# EAGLE board cartreader (EAGLE 7.6.0)
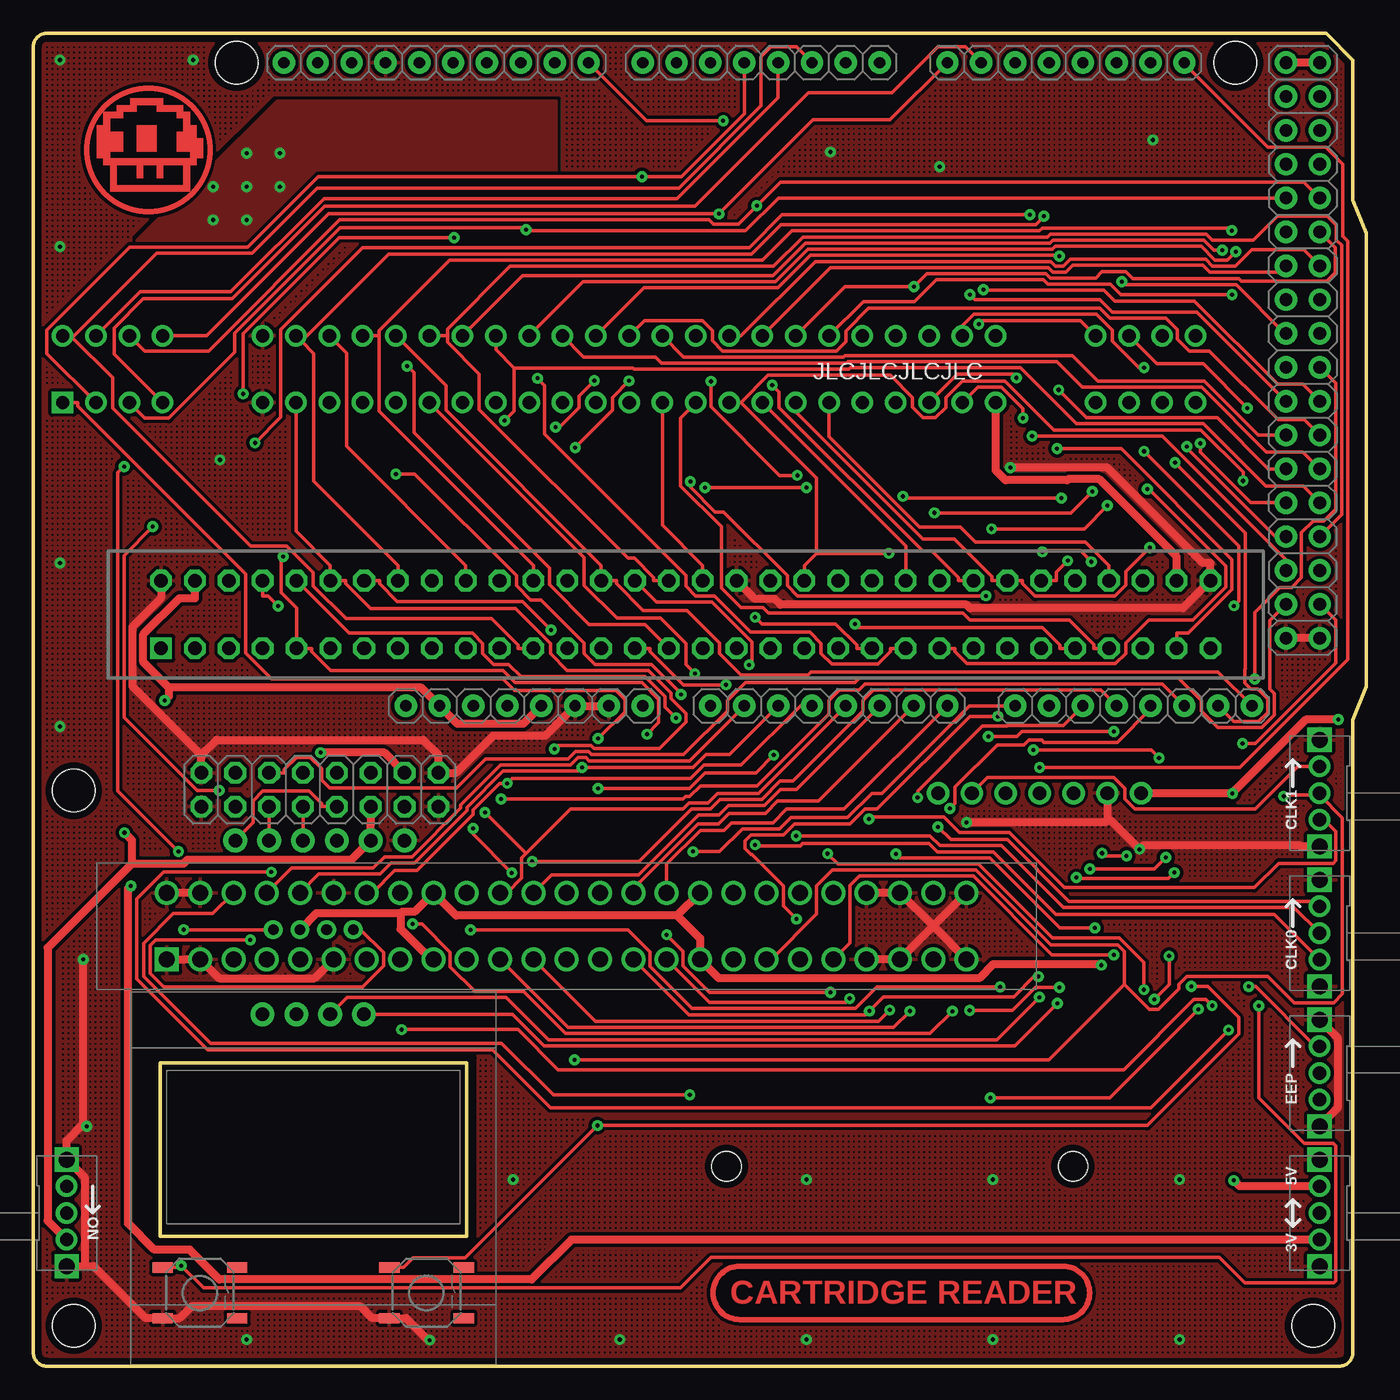
[diagram p1: board, top side]
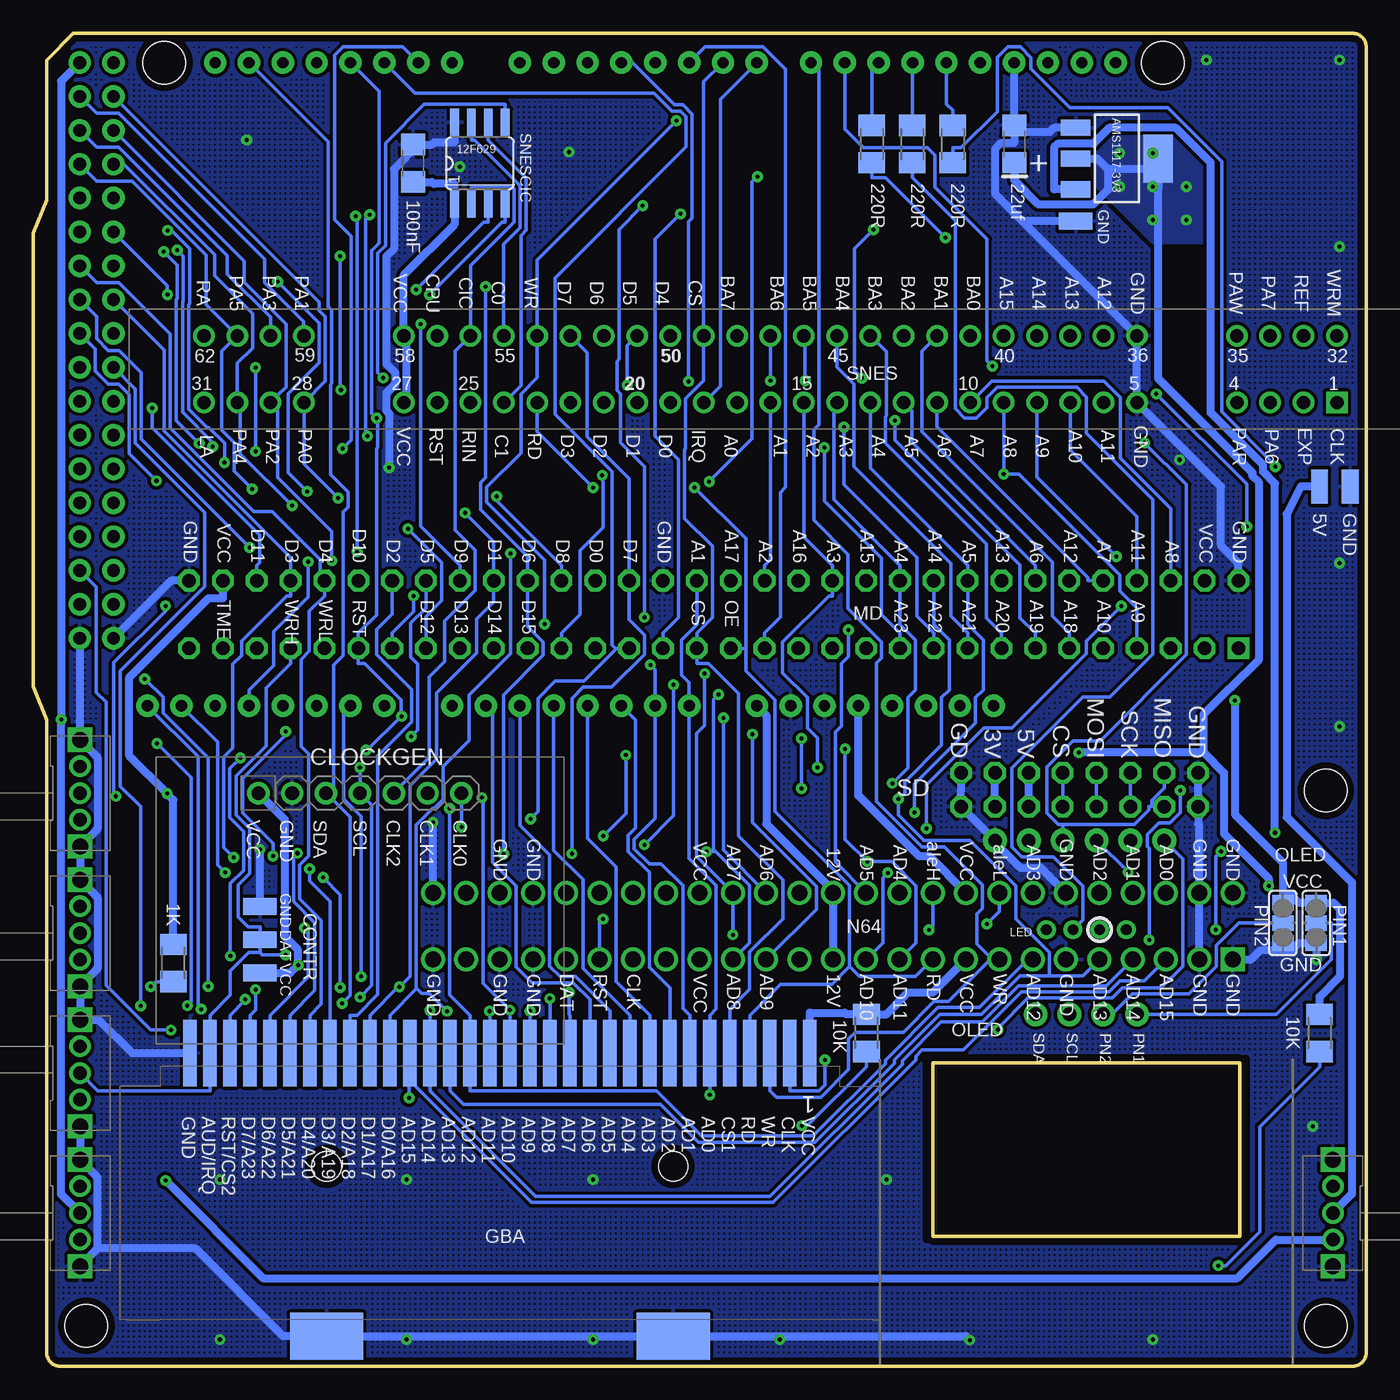
[diagram p2: board, bottom side, seen from below]

Size 100 x 100 mm. Coordinates in mm from the lower left corner, seen from the top.
Outline: 100,85 100,51 99,48.5 99,1 arc-90 98,0 1,0 arc-90 0,1 0,99 arc-90 1,100 97,100 99,98 99,87.5 100,85
Outline: 9.5,22.75 32.5,22.75 32.5,9.75 9.5,9.75 9.5,22.75
Copper layers (1*16): Top 0.035mm / dielectric 1.5mm / Bottom 0.035mm
Design rules "SparkFun_small": minimum track width 8mil, minimum drill 12mil, track to track 8mil, track to pad 8mil, pad to pad 8mil, via to via 8mil, smd to smd 8mil, copper to edge 20mil, drill to drill 12mil, minimum pad ring 12mil, minimum via ring 10mil, stop-mask expansion 4mil, vias tented up to drill 25mil, thermal gap 10mil
Net classes: 0 default: width 0.254 mm, drill 0.305 mm, clearance 0.203 mm; 1 power: width 0.61 mm, drill 0.406 mm, clearance 0.203 mm; 2 gnd: width 0.61 mm, drill 0.406 mm, clearance 0.203 mm; 3 power usb: width 0.61 mm, drill 0.406 mm, clearance 0.203 mm
Holes 3.2 mm at 3.04,3.04 96.02,3.04 3.04,43.18 15.24,97.8 90.17,97.8
tRestrict: area 9,9.5 to 33,23.1; area 5.8,88.1 to 11.8,88.6; area 5.8,88.6 to 6.2,89.1; area 11.2,88.6 to 11.8,89.1; area 5.8,89.1 to 6.2,89.6; area 7.8,89.1 to 8.2,89.6; area 9.2,89.1 to 9.8,89.6; area 11.2,89.1 to 11.8,89.6; area 5.8,89.6 to 6.2,90.1; area 7.8,89.6 to 8.2,90.1; area 9.2,89.6 to 9.8,90.1; area 11.2,89.6 to 11.8,90.1; 23 more areas; 7 lines
bRestrict: area 9,9.5 to 33,23.1

## Footprints (pad centres in the part's own frame; a part is rotated, then mirrored left to right if it is on the bottom)
M1206 = smd 1.6 x 2: 1 -1.4,0; 2 1.4,0
C1206 = smd 1.6 x 1.8: 1 -1.4,0; 2 1.4,0
1X08 = drill 0.85 pad 1.676: 1 -8.89,0; 2 -6.35,0; 3 -3.81,0; 4 -1.27,0; 5 1.27,0; 6 3.81,0; 7 6.35,0; 8 8.89,0
SOT223 = smd 1.219 x 2.235: 1 -2.311,-3.099; 2 0,-3.099; 3 2.311,-3.099 | smd 3.6 x 2.2: 4 0,3.099
PIC12F629 = smd 0.66 x 2.032: 1 -1.905,-3.073; 2 -0.635,-3.073; 3 0.635,-3.073; 4 1.905,-3.073; 5 1.905,3.073; 6 0.635,3.073; 7 -0.635,3.073; 8 -1.905,3.073
SWITCH-SPDT-2MM = drill 1: 1 0,2; 2 0,0; 3 0,-2 | drill 1.2 square: P$1 0,4; P$2 0,-4
CLOCKGEN = drill 1.016 pad 1.676: 1 -7.62,0; 2 -5.08,0; 3 -2.54,0; 4 0,0; 5 2.54,0; 6 5.08,0; 7 7.62,0
1X06-CLEANBIG = drill 1.016 pad 1.778: 1 -5.08,0; 2 -2.54,0; 3 0,0; 4 2.54,0; 5 5.08,0; 6 7.62,0
SMD1,27-2,54 = smd 1.27 x 2.54: 1 0,0
1X04-CLEANSMALL = drill 0.8 pad 1.422: 1 -3,0; 2 -1,0; 3 1,0; 4 3,0
MD-CART_SLOT = drill 1.016 square: 1 -39.37,-2.54 | drill 1.016 octagon: 2 -36.83,-2.54; 3 -34.29,-2.54; 4 -31.75,-2.54; 5 -29.21,-2.54; 6 -26.67,-2.54; 7 -24.13,-2.54; 8 -21.59,-2.54; 9 -19.05,-2.54; 10 -16.51,-2.54; 11 -13.97,-2.54; 12 -11.43,-2.54; 13 -8.89,-2.54; 14 -6.35,-2.54; 15 -3.81,-2.54; 16 -1.27,-2.54; 17 1.27,-2.54; 18 3.81,-2.54; 19 6.35,-2.54; 20 8.89,-2.54; 21 11.43,-2.54; 22 13.97,-2.54; 23 16.51,-2.54; 24 19.05,-2.54; 25 21.59,-2.54; 26 24.13,-2.54; 27 26.67,-2.54; 28 29.21,-2.54; 29 31.75,-2.54; 30 34.29,-2.54; 31 36.83,-2.54; 32 39.37,-2.54; 33 -39.37,2.54; 34 -36.83,2.54; 35 -34.29,2.54; 36 -31.75,2.54; 37 -29.21,2.54; 38 -26.67,2.54; 39 -24.13,2.54; 40 -21.59,2.54; 41 -19.05,2.54; 42 -16.51,2.54; 43 -13.97,2.54; 44 -11.43,2.54; 45 -8.89,2.54; 46 -6.35,2.54; 47 -3.81,2.54; 48 -1.27,2.54; 49 1.27,2.54; 50 3.81,2.54; 51 6.35,2.54; 52 8.89,2.54; 53 11.43,2.54; 54 13.97,2.54; 55 16.51,2.54; 56 19.05,2.54; 57 21.59,2.54; 58 24.13,2.54; 59 26.67,2.54; 60 29.21,2.54; 61 31.75,2.54; 62 34.29,2.54; 63 36.83,2.54; 64 39.37,2.54
OLED_I2C = drill 1.016 pad 1.778: 1 -3.81,0; 2 -1.27,0; 3 1.27,0; 4 3.81,0
1X10 = drill 0.85 pad 1.676: 1 -11.43,0; 2 -8.89,0; 3 -6.35,0; 4 -3.81,0; 5 -1.27,0; 6 1.27,0; 7 3.81,0; 8 6.35,0; 9 8.89,0; 10 11.43,0
TACTILE_SWITCH_SMD_5.2MM = smd 1.524 x 0.762: 1 -2.794,1.905; 2 2.794,1.905; 3 -2.794,-1.905; 4 2.794,-1.905
2X08 = drill 1.016 octagon: 1 -8.89,-1.27; 2 -8.89,1.27; 3 -6.35,-1.27; 4 -6.35,1.27; 5 -3.81,-1.27; 6 -3.81,1.27; 7 -1.27,-1.27; 8 -1.27,1.27; 9 1.27,-1.27; 10 1.27,1.27; 11 3.81,-1.27; 12 3.81,1.27; 13 6.35,-1.27; 14 6.35,1.27; 15 8.89,-1.27; 16 8.89,1.27
SJ_2 = smd 1.168 x 1.6: 1 -1.524,0; 2 0,0; 3 1.524,0
SNESCART_CONN_CLONE = drill 1 square: 1 -2.5,-42.5 | drill 1: 2 -2.5,-40; 3 -2.5,-37.5; 4 -2.5,-35; 5 -2.5,-27.5; 6 -2.5,-25; 7 -2.5,-22.5; 8 -2.5,-20; 9 -2.5,-17.5; 10 -2.5,-15; 11 -2.5,-12.5; 12 -2.5,-10; 13 -2.5,-7.5; 14 -2.5,-5; 15 -2.5,-2.5; 16 -2.5,0; 17 -2.5,2.5; 18 -2.5,5; 19 -2.5,7.5; 20 -2.5,10; 21 -2.5,12.5; 22 -2.5,15; 23 -2.5,17.5; 24 -2.5,20; 25 -2.5,22.5; 26 -2.5,25; 27 -2.5,27.5; 28 -2.5,35; 29 -2.5,37.5; 30 -2.5,40; 31 -2.5,42.5; 63 2.51,0.002; 64 2.51,-2.498; 65 2.51,-4.998; 66 2.51,-7.498; 67 2.51,-9.998; 68 2.51,2.502; 69 2.51,5.002; 70 2.51,7.502; 71 2.51,10.002; 72 2.51,12.502; 73 2.51,15.002; 74 2.51,17.502; 75 2.51,20.002; 76 2.51,-12.498; 77 2.51,-14.998; 78 2.51,-17.498; 79 2.51,-19.998; 80 2.51,-22.498; 81 2.51,22.502; 82 2.51,25.002; 83 2.51,27.502; 84 2.51,-27.498; 85 2.51,-24.998; 86 2.51,-34.998; 87 2.51,-37.498; 88 2.51,-39.998; 89 2.51,-42.498; 90 2.51,35.002; 91 2.51,37.502; 92 2.51,40.002; 93 2.51,42.502
N64-CART_SLOT_4 = drill 1.2 square: P1 -2.5,30 | drill 1.2: P2 -2.5,27.5; P3 -2.5,25; P4 -2.5,22.5; P5 -2.5,20; P6 -2.5,17.5; P7 -2.5,15; P8 -2.5,12.5; P9 -2.5,10; P10 -2.5,7.5; P11 -2.5,5; P12 -2.5,2.5; P13 -2.5,0; P14 -2.5,-2.5; P15 -2.5,-5; P16 -2.5,-7.5; P17 -2.5,-10; P18 -2.5,-12.5; P19 -2.5,-15; P20 -2.5,-17.5; P21 -2.5,-20; P22 -2.5,-22.5; P23 -2.5,-25; P24 -2.5,-27.5; P25 -2.5,-30; P26 2.5,30; P27 2.5,27.5; P28 2.5,25; P29 2.5,22.5; P30 2.5,20; P31 2.5,17.5; P32 2.5,15; P33 2.5,12.5; P34 2.5,10; P35 2.5,7.5; P36 2.5,5; P37 2.5,2.5; P38 2.5,0; P39 2.5,-2.5; P40 2.5,-5; P41 2.5,-7.5; P42 2.5,-10; P43 2.5,-12.5; P44 2.5,-15; P45 2.5,-17.5; P46 2.5,-20; P47 2.5,-22.5; P48 2.5,-25; P49 2.5,-27.5; P50 2.5,-30
GBA-SLOT-B = smd 5 x 1: 1 -5,23.25; 2 -5,21.75; 3 -5,20.25; 4 -5,18.75; 5 -5,17.25; 6 -5,15.75; 7 -5,14.25; 8 -5,12.75; 9 -5,11.25; 10 -5,9.75; 11 -5,8.25; 12 -5,6.75; 13 -5,5.25; 14 -5,3.75; 15 -5,2.25; 16 -5,0.75; 17 -5,-0.75; 18 -5,-2.25; 19 -5,-3.75; 20 -5,-5.25; 21 -5,-6.75; 22 -5,-8.25; 23 -5,-9.75; 24 -5,-11.25; 25 -5,-12.75; 26 -5,-14.25; 27 -5,-15.75; 28 -5,-17.25; 29 -5,-18.75; 30 -5,-20.25; 31 -5,-21.75; 32 -5,-23.25 | smd 3.5 x 5.5: SHIELD_3 16.25,13; SHIELD_4 16.25,-13 | hole 2.2: 3.5,13; 3.5,-13
2X18 = drill 0.95 pad 1.676: 1 -21.59,-1.27; 2 -21.59,1.27; 3 -19.05,-1.27; 4 -19.05,1.27; 5 -16.51,-1.27; 6 -16.51,1.27; 7 -13.97,-1.27; 8 -13.97,1.27; 9 -11.43,-1.27; 10 -11.43,1.27; 11 -8.89,-1.27; 12 -8.89,1.27; 13 -6.35,-1.27; 14 -6.35,1.27; 15 -3.81,-1.27; 16 -3.81,1.27; 17 -1.27,-1.27; 18 -1.27,1.27; 19 1.27,-1.27; 20 1.27,1.27; 21 3.81,-1.27; 22 3.81,1.27; 23 6.35,-1.27; 24 6.35,1.27; 25 8.89,-1.27; 26 8.89,1.27; 27 11.43,-1.27; 28 11.43,1.27; 29 13.97,-1.27; 30 13.97,1.27; 31 16.51,-1.27; 32 16.51,1.27; 33 19.05,-1.27; 34 19.05,1.27; 35 21.59,-1.27; 36 21.59,1.27

## Placement (x,y rotation side)
1K  [M1206]  89.5,30.25 270 bottom
10K  [M1206]  3.5,25 90 bottom
100NF  [C1206]  71.5,90.25 90 bottom
220R  [M1206]  31.02,91.69 90 bottom
1000R  [M1206]  37.5,25 90 bottom
+22UF  [C1206]  26.41,91.69 90 bottom
ADCH  8x1F-H8.5  [1X08]  82.55,49.54 0 top
ADCL  8x1F-H8.5  [1X08]  59.69,49.54 0 top
AMS1117-3V3  [SOT223]  18.7,90.6 270 bottom
CIC  PIC12F629_SIMPLE  [PIC12F629]  66.5,90.25 0 bottom
CLK0  [SWITCH-SPDT-2MM]  96.5,32.5 180 bottom
CLK1  [SWITCH-SPDT-2MM]  96.5,43 180 bottom
CLOCKGEN  [CLOCKGEN]  75.5,43 0 bottom
CN2  THT-PINHEADER_1X6-CLEANBIG  [1X06-CLEANBIG]  20.23,39.44 0 top
COMMUNICATION  8x1F-H8.5  [1X08]  77.47,97.8 180 top
CONTROLLER  [SMD1,27-2,54]  83,32 270 bottom
EEP  [SWITCH-SPDT-2MM]  96.5,22 0 top
LED  THT-PINHEADER_1X4_2MM-CLEANBIG  [1X04-CLEANSMALL]  21,32.75 0 top
MEGADRIVE  MD-CART_SLOT  [MD-CART_SLOT]  48.95,56.4 0 top
OLED  OLED_I2C-CLEANBIG  [OLED_I2C]  21,26.4 0 top
ONOFF  [SWITCH-SPDT-2MM]  2.5,11.5 180 top
PAD1  [SMD1,27-2,54]  21.8,85.9 270 bottom
PAD2  [SMD1,27-2,54]  83,34.5 270 bottom
PAD3  [SMD1,27-2,54]  83,29.5 270 bottom
PINS  10x1F-H8.5  [1X10]  30.23,97.8 0 top
POWER  8x1F-H8.5  [1X08]  36.83,49.54 0 top
PWML  8x1F-H8.5  [1X08]  54.61,97.8 180 top
R19  [M1206]  34.06,91.69 90 bottom
R20  [M1206]  37.1,91.69 90 bottom
S1  MOMENTARY-SWITCH-SPST-SMD-5.2MM  [TACTILE_SWITCH_SMD_5.2MM]  12.5,5.5 0 top
S2  MOMENTARY-SWITCH-SPST-SMD-5.2MM  [TACTILE_SWITCH_SMD_5.2MM]  29.5,5.5 0 top
SDCARD  [2X08]  21.5,43.25 180 top
SJ2  [SJ_2]  3.75,33.25 90 bottom
SJ4  [SJ_2]  6.25,33.25 90 bottom
U$1  SNESCART_CONN_CLONE  [SNESCART_CONN_CLONE]  44.7,74.8 90 bottom
U$2  N64-CART_SLOT_4  [N64-CART_SLOT_4]  40.02,33.02 90 top
U$4  GBA-SLOT-BSMD  [GBA-SLOT-B]  65,18.5 270 bottom
USB5V  [SMD1,27-2,54]  3.5,66 180 bottom
USBGND  [SMD1,27-2,54]  1.2,66 0 bottom
VOLTAGE  [SWITCH-SPDT-2MM]  96.5,11.5 180 bottom
XIO  18x2F-H8.5  [2X18]  95.25,76.21 270 top

## Tracks (layer width: path | path; a pad name or v marks a point on that pad's centre or on a via)
3V3  (via drill 0.3 pad 0.81)
  Top 0.61: SDCARD.3 26.34,46.03 v21.55,46.03 | VOLTAGE.1 40.38,9.5 37.39,6.52 13.96,6.52 11.73,8.74 9.07,8.74 7.1,10.71 7.1,35.81 v7.32,36.03
  Bottom 0.61: 12.19,46.03 v21.55,46.03 | 12.19,46.03 12.19,48.91 10.23,50.87 10.2,50.87 8.04,53.04 8.04,66.28 8.54,66.78 8.54,67.04 15.6,74.11 15.6,88.29 15.6,89.8 | 12.19,46.03 10.67,44.51 10.67,39.96 7.32,36.6 v7.32,36.03 | 19.37,89.8 20.17,90.6 AMS1117-3V3.2 | 15.6,89.8 19.37,89.8 | 19.37,89.8 19.37,88.27 20.49,87.15 24.58,87.15 26.41,88.98 +22UF.1 | AMS1117-3V3.4 15.6,89.8 | SDCARD.4 SDCARD.3
  other vias: 16,91 18.5,91 18.5,88.5 16,88.5 16,86 13.5,86 13.5,88.5
  pour Bottom (isolate 0.254, no thermals): 14.5,92.4 12.2,90.1 12.2,84.3 15.1,84.3 16,84.3 20.2,88.5 20.2,91.2 19,92.4
  pour Top (isolate 0.254, no thermals): 16.05,83.95 7.25,83.95 18.3,94.9 39.2,94.9 39.2,89.6 21.2,89.6 21.2,89.5
5V  (via drill 0.3 pad 0.81)
  Top 0.61: VOLTAGE.3 90.51,13.5 v90.08,13.93 | 7.41,37.71 7.41,39.45 v6.84,40.02 | 7.41,37.71 11.27,37.71 11.57,38.02 23.89,38.02 CN2.5 25.31,40.66 SDCARD.6 | 7.41,37.71 1.08,31.38 1.08,10.92 ONOFF.1
  Bottom 0.61: v90.08,13.93 82.76,6.61 9.67,6.61 6.78,9.5 ONOFF.1 | v6.84,40.02 6.84,66.23 7.72,67.12 7.72,67.59 11.67,71.53 11.67,90.3 14.28,92.91 19.28,92.91 20.47,91.72 23.15,91.72 23.42,91.44 23.42,88.29 AMS1117-3V3.3 | SDCARD.6 SDCARD.5
ADC0  (via drill 0.3 pad 0.81)
  Top 0.254: MEGADRIVE.49 50.22,60.08 47.2,63.1 U$1.17 | U$2.P28 13.47,33.97 10.5,33.97 8.27,31.73 8.27,29.26 13.3,24.23 35.13,24.23 39.02,20.35 v49.25,20.35
  Bottom 0.254: MEGADRIVE.49 50.22,57.8 50.22,55.65 51.38,54.49 51.38,51.87 50.8,51.3 ADCL.1 50.8,38.09 48.77,36.06 48.77,26.81 49.25,26.33 U$4.6 49.25,22.09 49.25,20.67 v49.25,20.35
ADC1  (via drill 0.3 pad 0.81)
  Top 0.254: ADCL.2 49.22,45.42 41.7,45.42 41.46,45.66 40.85,45.66 40.29,45.11 | 40.29,45.11 | 40.29,45.11 35.07,45.11 32.07,42.1 32.07,41.88 28.41,38.22 26.34,38.22 25.5,37.38 19.38,37.38 U$2.P29 | v53.71,52.62 53.93,52.84 53.93,54.33 50.92,57.34 46.74,57.34 MEGADRIVE.47
  Bottom 0.254: U$4.7 50.75,26.33 51.27,26.85 51.27,36.05 52.89,37.67 53.77,37.67 54.92,38.82 54.92,39.52 53.34,41.09 ADCL.2 53.34,52.25 v53.71,52.62 | MEGADRIVE.47 45.14,60.08 44.7,60.52 U$1.16
ADC2  (via drill 0.3 pad 0.81)
  Top 0.254: ADCL.3 52.22,45.88 50.46,45.88 49.51,44.93 v41.16,44.93 40.88,44.65 35.26,44.65 32.53,41.91 32.53,41.69 28.6,37.76 26.86,37.76 26.02,36.92 21.42,36.92 U$2.P30
  Bottom 0.254: ADCL.3 54.81,48.47 54.81,40.38 55.37,39.82 55.37,38.63 53.77,37.03 53.77,29.92 52.25,28.4 U$4.8 | v41.16,44.93 41.16,47.13 41.91,47.89 41.91,50.15 43.77,52.01 43.77,54.32 40.3,57.8 40.06,57.8 MEGADRIVE.45 40.06,60.08 42.2,62.22 U$1.15
ADC3  (via drill 0.3 pad 0.81)
  Top 0.254: ADCL.4 57.54,49.54 53.09,45.09 50.31,45.09 49.32,44.1 35.92,44.1 v35.56,43.73 34.99,43.73 32.98,41.72 32.98,41.38 28.8,37.19 27.11,37.19 25.44,35.52 U$2.P32
  Bottom 0.254: U$4.9 53.75,26.33 56.27,28.85 56.27,37.44 58.42,39.59 ADCL.4 | v35.56,43.73 34.39,44.9 34.39,50.15 33.8,50.74 33.8,54.47 34.98,55.65 34.98,57.8 MEGADRIVE.43 34.98,60.08 39.92,65.02 39.92,72.08 U$1.14
ADC4  (via drill 0.3 pad 0.81)
  Top 0.254: 36.96,38.47 40.3,41.81 48.75,41.81 49.21,42.27 50.61,42.27 51.32,42.98 54.4,42.98 ADCL.5 | 36.96,38.47 36.63,38.14 36.63,36.62 35.53,35.52 U$2.P36 | 36.96,38.47 v33.88,41.55
  Bottom 0.254: U$1.13 37.2,67.38 29.9,60.08 MEGADRIVE.41 29.9,55.65 28.73,54.48 28.73,50.73 29.31,50.15 29.31,48.26 33.88,43.69 v33.88,41.55 | U$4.10 55.25,26.33 58.77,29.85 58.77,36.5 60.96,38.69 ADCL.5
ADC5  (via drill 0.3 pad 0.81)
  Top 0.254: MEGADRIVE.39 25.96,58.94 25.96,58.7 27.29,57.38 36.71,57.38 v38.84,55.24 | U$2.P37 38.87,36.87 45.41,36.87 49.9,41.35 51.43,41.35 52.14,42.06 54.85,42.06 56.06,43.28 57.24,43.28 ADCL.6
  Bottom 0.254: U$2.P37 39.83,37.83 39.83,47.57 39.37,48.03 39.37,52.72 38.84,53.25 v38.84,55.24 | ADCL.6 63.5,40.59 61.26,38.34 61.26,30.01 60.48,29.23 59.31,29.23 56.75,26.67 56.75,26.33 U$4.11 | MEGADRIVE.39 24.82,60.08 34.07,69.33 34.07,71.67 U$1.12
ADC6  (via drill 0.3 pad 0.81)
  Top 0.254: U$2.P40 45.02,35.83 49.86,40.67 51.39,40.67 52.21,41.49 54.92,41.49 55.84,42.41 58.91,42.41 ADCL.7 | MEGADRIVE.37 23.68,55 32.94,55 33.71,54.24 33.71,53.47 34.52,52.66 35.67,52.66 36.58,51.74 45.89,51.74 47.39,50.24 47.39,49.45 v48.22,48.63
  Bottom 0.254: U$2.P40 48.22,38.72 v48.22,48.63 | U$1.11 32.2,70.48 20.88,59.16 20.88,58.94 MEGADRIVE.37 | ADCL.7 65.53,49.03 65.53,37.81 63.77,36.05 63.77,29.97 62.57,28.77 59.5,28.77 58.25,27.52 U$4.12
ADC7  (via drill 0.3 pad 0.81)
  Top 0.254: U$2.P41 47.52,37.67 50.06,40.21 51.83,40.21 52.39,40.77 55.5,40.77 56.52,41.79 60.83,41.79 ADCL.8 | U$1.10 41.33,60.67 41.33,58.58 43.8,56.12 47.06,56.12 48.95,54.23 48.95,52.63 v49.63,51.95 | v59.81,28.04 50.74,28.04 48.76,30.02 48.76,31.14 v47.52,32.37
  Bottom 0.254: v49.63,51.95 49.63,48.09 50.24,47.47 50.24,38.24 U$2.P41 v47.52,32.37 | v59.81,28.04 59.81,26.39 59.75,26.33 U$4.13 | U$1.10 28.1,73.9 19.68,73.9 18.45,72.67 18.45,68.12 14.66,64.33 14.66,60.08 MEGADRIVE.35
ADC8  (via drill 0.3 pad 0.81)
  Top 0.254: v61.25,27.58 60.97,27.3 50.74,27.3 U$2.P16 | ADCH.1 70.23,49.54 63.68,42.98 62.92,42.98 61.09,41.15 56.83,41.15 55.99,40.32 53.2,40.32 51.49,38.6 v49.51,38.6 | v48.59,50.39 48.59,50.46 46.39,52.66 42.14,52.66 41.33,53.47 41.33,54.26 38.11,57.48 37.32,57.48 36.25,58.55 36.25,59.3 28.62,66.93 v27.2,66.93
  Bottom 0.254: 48.97,38.6 48.97,50 v48.59,50.39 | U$2.P16 46.27,31.77 46.27,36.06 48.82,38.6 48.97,38.6 | 48.97,38.6 v49.51,38.6 | v61.25,27.58 61.25,26.33 U$4.14 | U$1.9 v27.2,66.93 26.06,66.93 18.47,59.34 18.47,58.17 17.2,56.9 17.2,55 MEGADRIVE.4
ADC9  (via drill 0.3 pad 0.81)
  Top 0.254: v75.4,29.23 75.08,29.23 73.56,27.71 63.8,27.71 v62.72,26.64 62.42,26.34 49.2,26.34 U$2.P15 | v18.74,60.74 18.59,60.59 18.59,58.03 19.74,56.88 19.74,55 MEGADRIVE.5 20.88,53.86 20.88,53.62 22.3,52.2 35.25,52.2 36.16,51.29 45.65,51.29 46.92,50.01 46.92,48.3 v46.03,47.41
  Bottom 0.254: ADCH.2 76.7,49.04 76.7,42.55 75.4,41.25 v75.4,29.23 | U$4.15 62.75,26.33 62.72,26.36 v62.72,26.64 | U$1.8 24.7,66.7 v18.74,60.74 | U$2.P15 41.26,34.28 41.26,36 46.03,40.78 v46.03,47.41
ADC10  (via drill 0.3 pad 0.81)
  Top 0.254: v66.35,42.66 66.35,43.17 71.2,48.02 73.05,48.02 73.11,48.07 77.27,48.07 ADCH.3 | U$2.P12 42.17,25.87 63.4,25.87 v64.25,26.72 | v35.9,37.02 32.99,39.93 v32.99,40.34 | MEGADRIVE.36 17.2,57.8 17.62,57.8 v18.38,57.03
  Bottom 0.254: v66.35,42.66 66.27,42.57 66.27,28.74 v64.25,26.72 64.25,26.33 U$4.16 | v18.38,57.03 21.01,54.41 21.01,53.45 26.57,47.9 28.69,47.9 32.99,43.6 v32.99,40.34 | U$1.7 22.2,68.74 17.2,63.74 17.2,60.08 MEGADRIVE.36 | U$2.P12 36.27,31.77 36.27,36.65 v35.9,37.02
ADC11  (via drill 0.3 pad 0.81)
  Top 0.254: v39.09,46.3 39.37,46.58 41.84,46.58 42.08,46.34 46.99,46.34 48.97,48.32 48.97,48.96 47.85,50.08 47.85,50.49 46.14,52.2 40.06,52.2 38.79,53.47 38.79,54.24 36.2,56.83 25.29,56.83 23.42,58.7 23.42,58.94 MEGADRIVE.38 22.28,60.08 19.7,62.66 U$1.6 | v37.43,37.86 45.44,37.86 49.4,41.81 50.8,41.81 51.51,42.52 54.66,42.52 56.04,43.9 56.98,43.9 62.23,49.15 62.23,49.94 63.02,50.73 80.09,50.73 ADCH.4 | U$2.P11 40.13,25.41 64.53,25.41 v65.76,26.64
  Bottom 0.254: v39.09,46.3 39.09,39.51 v37.43,37.86 35.6,37.86 33.77,36.03 33.77,31.77 U$2.P11 | U$4.17 65.75,26.33 65.76,26.34 v65.76,26.64
ADC12  (via drill 0.3 pad 0.81)
  Top 0.254: v79.37,60.35 78.54,61.18 75.79,61.18 v75.7,61.1 | ADCH.5 83.82,49.3 81.32,46.8 75.82,46.8 75.65,46.97 74.69,46.97 74.32,46.6 72.31,46.6 69.15,43.44 69.15,42.22 v68.77,41.84 | v75.83,86.28 75.2,85.65 56.09,85.65 53.87,83.44 26.66,83.44 20.12,76.89 | 20.12,76.89 21.03,75.98 21.03,66.41 27.36,60.08 MEGADRIVE.40 | U$1.85 20.12,76.89
  Bottom 0.254: v75.83,86.28 75.7,86.15 v75.7,61.1 | v68.77,41.84 68.77,27.85 67.25,26.33 67.25,24.91 U$4.18 67.25,20.67 53.26,20.67 49.87,17.28 41.49,17.28 36.09,22.69 36.09,22.93 32.12,26.9 29.01,26.9 25.4,30.52 U$2.P7 | ADCH.5 83.82,50.73 81.97,52.58 81.97,55.12 79.37,57.71 v79.37,60.35
ADC13  (via drill 0.3 pad 0.81)
  Top 0.254: v35.08,42.55 48.74,42.55 48.92,42.73 49.24,42.73 50.05,43.53 54.31,43.53 59.69,48.92 59.69,49.94 60.47,50.73 61.94,50.73 62.4,51.19 84.72,51.19 ADCH.6 | MEGADRIVE.42 32.44,60.08 23.51,69.02 23.51,76 U$1.80
  Bottom 0.254: 23.75,29.27 23.75,31.03 26.27,33.55 26.27,36.02 29.71,39.46 33.17,39.46 35.08,41.37 v35.08,42.55 34.62,43.02 34.62,43.83 31.85,46.59 31.85,50.15 31.26,50.74 31.26,54.47 32.44,55.65 MEGADRIVE.42 | 23.75,29.27 26,29.27 28.87,26.4 | 28.87,26.4 | 28.87,26.4 31.97,26.4 35.4,22.97 35.4,22.73 41.35,16.77 50.08,16.77 52.93,19.63 67.71,19.63 68.75,20.67 U$4.19 | U$2.P5 21.27,29.27 23.75,29.27
ADC14  (via drill 0.3 pad 0.81)
  Top 0.254: v85.6,37.03 85.15,36.58 78.34,36.58 v78.26,36.66 | v85.66,67.78 90.94,62.51 90.94,52.3 90.89,52.25 90.89,51.25 91.33,50.82 91.86,50.82 92.61,50.06 92.61,49.06 91.92,48.36 90.08,48.36 ADCH.7 | v70.25,26.69 73.45,26.69 75.19,28.42 v76.97,28.42 | v89.92,85.21 89.73,85.39 75.69,85.39 75.5,85.19 56.92,85.19 54.71,82.98 31.23,82.98 25.95,77.7 25.95,77.31 | 25.95,77.31 25.95,71.65 37.52,60.08 MEGADRIVE.44 | U$1.79 25.95,77.31
  Bottom 0.254: v76.97,28.42 76.97,35.38 v78.26,36.66 | v70.25,26.69 70.25,26.33 70.25,24.88 U$4.20 70.25,20.67 62.31,12.73 44.73,12.73 34.81,22.66 34.81,22.92 31.89,25.83 28.79,25.83 26.09,28.53 | v85.66,67.78 85.66,69.25 86.84,70.43 86.97,70.43 88.35,71.81 88.35,79.64 88.29,79.71 88.29,83.86 89.63,85.21 v89.92,85.21 | 26.09,28.53 | 26.09,28.53 19.51,28.53 U$2.P4 | v85.6,37.03 86.18,37.6 86.18,46.82 ADCH.7
ADC15  (via drill 0.3 pad 0.81)
  Top 0.254: ADCH.8 88.88,52.1 58.35,52.1 58.11,51.86 53.1,51.86 51.49,53.47 51.49,54.24 49.03,56.7 45.74,56.7 43.74,58.7 43.74,58.94 MEGADRIVE.46 42.6,59.23 42.6,60.08 30.95,71.73 30.95,73.56 | v87.41,26.79 80.75,20.13 v71.81,20.13 | 30.95,73.56 | 30.95,73.56 U$1.78
  Bottom 0.254: v87.41,26.79 87.63,27 87.63,45.73 ADCH.8 | 71.81,21.47 v71.81,20.13 | 71.81,21.47 62.62,12.28 44.5,12.28 33.8,22.98 33.8,23.25 33.32,23.73 30.2,23.73 25.86,28.08 19.32,28.08 18.49,28.9 16.64,28.9 U$2.P3 | 71.81,21.47 71.75,21.53 71.75,22.09 U$4.21
CICDATA0
  Bottom 0.254: U$1.75 64.7,84.18 63.47,85.41 63.47,88.56 66.89,91.98 67.14,91.98 CIC.7
CICDATA1
  Bottom 0.254: CIC.6 65.86,91.98 63.02,89.13 63.02,85.22 63.41,84.82 63.41,73.58 U$1.24
CICRSTSO  (via drill 0.3 pad 0.81)
  Top 0.254: U$1.25 69.34,74.44 73.48,74.44 v73.77,74.15
  Bottom 0.254: v73.77,74.15 74.15,74.53 74.15,83.51 73.58,84.08 73.58,91.76 70.67,94.67 64.59,94.67 CIC.5
CLK  (via drill 0.3 pad 0.81)
  Top 0.254: v55.55,45.84 54.22,44.51 50.38,44.51 49.23,43.35 v42.38,43.35 | v57.24,39.78 67.28,39.78 68,39.06 72.64,39.06 77.28,34.41 94.58,34.41 CLK0.2 | v42.38,47.09 44.39,49.1 44.39,50.02 43.7,50.71 36.09,50.71 35.25,51.55 17.87,51.55 15.93,53.49 15.93,59.44 3.33,72.03 3.33,72.3 U$1.1
  Bottom 0.254: v42.38,47.09 v42.38,43.35 | v57.24,39.78 55.55,41.47 v55.55,45.84
CLK0  (via drill 0.3 pad 0.81)
  Top 0.254: CLK0.3 96.13,34.87 77.71,34.87 73.07,39.51 68.83,39.51 v67.88,40.46
  Bottom 0.254: CLOCKGEN.7 v67.88,40.46
CLK1
  Top 0.254: CLOCKGEN.6 71.59,44.17 81.08,44.17 81.91,43.34 81.91,42.56 82.64,41.82 91.7,41.82 94.88,45 CLK1.3
CLK2
  Bottom 0.254: CLOCKGEN.5 70.29,45.67 70.29,51.7 69.14,52.85 69.14,55.9 66.84,58.2 66.84,61.23 68.34,62.74 68.34,76.17 U$1.81 67.2,82.56 63.93,85.83 63.93,88.36 64.09,88.52 67.14,88.52 CIC.2
CPUCLK  (via drill 0.3 pad 0.81)
  Top 0.254: v40.62,22.99 76.2,22.99 81.86,28.65 | 96.5,42.86 98.21,41.15 98.21,27.92 97.56,27.27 94.61,27.27 92.61,29.26 86.56,29.26 85.95,28.66 85.95,28.32 84.39,26.76 83.75,26.76 81.86,28.65 | U$1.82 69.7,78.06 70.56,78.92 79.76,78.92 80.95,77.73 80.95,76.91 82.93,74.93 v83.33,74.93 | 81.86,28.65 81.86,31.12 81.38,31.6 76.35,31.6 70.72,37.23 59.96,37.23 58.77,36.04 58.77,33.92 55.37,30.52 U$2.P19 | v90.08,57.04 90.44,57.41 90.44,61.53 v83.33,68.64 | 96.5,42.86 93.91,42.86 v93.8,42.76 | 96.5,42.86 CLK1.2
  Bottom 0.254: v93.8,42.76 93.95,42.91 93.95,52.78 90.08,56.65 v90.08,57.04 | U$4.2 43.25,20.67 41.07,20.67 40.62,21.12 v40.62,22.99 | v83.33,74.93 v83.33,68.64
GND  (via drill 0.3 pad 0.81)
  Top 0.61: v29.74,1.96 29.61,1.96 27.98,3.6 S2.3 25.44,3.6 24.55,4.48 11.87,4.48 10.98,3.6 S1.3 8.44,3.6 4.53,7.5 3.88,7.5 | EEP.P$1 97.87,24.63 97.87,19.37 EEP.P$2 | 80.58,40.93 80.45,40.79 v70.02,40.79 | 80.58,40.93 80.85,40.93 v83,38.78 83.3,39.08 95,39.08 95.09,39 CLK1.P$1 | CLOCKGEN.2 80.58,40.93 | U$2.P47 U$2.P48 67.52,33.02 | v73.3,67.43 80.57,67.43 87.73,60.26 88.32,60.26 MEGADRIVE.64 86.25,56.87 70.27,56.87 70.01,57.13 56.04,57.13 55.61,57.56 54.14,57.56 MEGADRIVE.50 | U$2.P22 U$2.P23 67.52,33.02 | v3.75,30.52 3.75,18.16 2.5,16.91 ONOFF.P$2 3.88,14.12 3.88,7.5 | ONOFF.P$1 3.88,7.5 | U$2.P27 U$2.P26 | 12.61,45.84 13.75,46.98 29.25,46.98 30.39,45.84 SDCARD.1 31.71,44.52 34.49,47.3 38.4,47.3 POWER.6 POWER.7 | 12.61,45.84 12.61,45.64 SDCARD.15 | MEGADRIVE.33 9.58,57.62 7.44,55.48 7.44,51.01 12.61,45.84 | U$2.P50 67.52,33.02 | 67.52,33.02 U$2.P25 | U$2.P6 21.1,29.1 13.94,29.1 U$2.P2 11.43,30.52 U$2.P1 | XIO.36 XIO.35
  Bottom 0.61: v29.74,1.96 30.04,2.25 U$4.SHIELD_3 U$4.SHIELD_4 81.26,2.25 87.83,8.83 95.17,8.83 | AMS1117-3V3.1 23.42,92.91 23.73,92.61 26.41,92.61 | 26.41,92.61 26.41,91.78 27.39,91.78 27.82,91.36 27.82,87.93 26.15,86.25 | 26.41,92.61 +22UF.2 26.41,94.4 26.42,94.4 PINS.4 | 25.45,85.55 U$1.84 U$1.5 10.9,66 10.9,61.58 9.58,60.26 MEGADRIVE.33 | 25.45,85.55 26.15,86.25 | U$4.32 92.59,23.5 95.09,26 EEP.P$1 CLK0.P$1 95.17,29.83 95.17,35.17 CLK0.P$2 CLK1.P$1 95.18,40.32 95.18,45.68 CLK1.P$2 96.5,48.41 96.52,48.43 XIO.36 | U$2.P50 v70.02,40.79 | v83,38.78 83,35.64 PAD2.1 | EEP.P$2 VOLTAGE.P$2 95.17,14.17 95.17,8.83 | 70.8,91.65 71.12,91.65 72.95,89.82 72.95,83.82 73.52,83.25 73.52,75.21 72.85,74.54 72.85,73.68 73.51,73.01 73.51,71.68 73.3,71.46 v73.3,67.43 | v3.75,30.52 3.75,30.63 SJ2.1 5.06,31.73 5.6,31.18 6.25,31.18 | U$2.P31 24.39,37.39 25.94,37.39 27.85,39.29 CN2.6 SDCARD.2 30.39,43.2 SDCARD.1 | U$2.P1 8.61,30.52 7.95,31.18 6.25,31.18 | U$2.P2 U$2.P27 12.52,40.57 12.61,40.66 SDCARD.16 SDCARD.15 | SJ4.1 6.25,31.18 | XIO.35 89.66,58.94 89.64,58.94 MEGADRIVE.64 | VOLTAGE.P$1 95.17,8.83 | 70.8,91.65 70.09,91.65 69.94,91.8 68.41,91.8 CIC.8 | 100NF.2 70.8,91.65 | 25.39,85.5 25.45,85.55 | PAD1.1 25.79,85.9 26.15,86.25
  other vias: 84,92 68,90 12,98 2,98 2,84 2,60.25 2,48 4,18 16,2 44,2 58,2 72,2 86,2 72,14 36,14 14,68 86,14 58,14 59.8,91.1
  pour Bottom (isolate 0.254, rank 2, hatched): 0,100 100,100 100,0 0,0
  pour Top (isolate 0.254, rank 2, hatched): 0,100 100,100 100,0 0,0
N$1  (via drill 0.3 pad 0.81)
  Top 0.254: EEP.1 96.19,24 91.71,28.48 v91.2,28.48
  Bottom 0.254: v91.2,28.48 90.83,28.85 1K.2
N$2
  Bottom 0.61: USB5V.1 4.89,66 5.96,63.93 5.96,41.2 1.07,36.31 1.07,12.93 ONOFF.2
N$3
  Top 0.406: 53,7.5 77.25,7.5 arc-90 79.25,5.5 arc-90 77.25,3.5 53,3.5 arc-90 51,5.5 arc-90 53,7.5
N$8
  Bottom 0.254: OLED.1 6.76,26.4 2.62,30.54 2.62,33.25 SJ2.2
N$9
  Bottom 0.254: OLED.2 19.08,26.4 17.55,27.93 13.32,27.93 11.26,30 11.26,31.56 9.57,33.25 7.38,33.25 SJ4.2
N$56
  Bottom 0.254: 220R.2 31.02,94.22 31.5,94.7 PINS.6
N$57
  Bottom 0.254: R19.2 34.06,94.22 34.04,94.24 PINS.7
N$58
  Bottom 0.254: R20.2 37.1,97.28 PINS.8
PA0  (via drill 0.3 pad 0.81)
  Top 0.254: v77.14,65.14 65.36,65.14 v65.24,65.26
  Bottom 0.254: XIO.3 78.56,79.84 78.56,79.2 78.11,78.74 78.11,73.89 U$1.28 79.7,67.7 v77.14,65.14 | v65.24,65.26 65.24,64.94 60.38,60.08 MEGADRIVE.53
PA1  (via drill 0.3 pad 0.81)
  Top 0.254: U$1.90 78.55,78.46 71.2,78.46 v70.93,78.19
  Bottom 0.254: XIO.4 95.25,93.99 93.59,93.99 82.64,83.04 82.64,81.29 79.7,78.35 U$1.90 | v70.93,78.19 70.93,63.01 68,60.08 MEGADRIVE.56
PA2  (via drill 0.3 pad 0.81)
  Top 0.254: v77.6,60.43 76.76,59.59 76.76,58.94 MEGADRIVE.59
  Bottom 0.254: 81.66,72.3 81.66,66.68 77.6,62.63 v77.6,60.43 | 81.66,72.3 81.66,72.84 81.05,73.45 81.05,78.19 84.18,81.32 84.18,82.92 XIO.5 | U$1.29 81.66,72.3
PA3  (via drill 0.3 pad 0.81)
  Top 0.254: U$1.91 84.31,75.2 87.77,75.2 v91.09,71.88
  Bottom 0.254: v91.09,71.88 91.09,70.43 83.03,62.37 83.03,60.29 83.24,60.08 MEGADRIVE.62 | XIO.6 95.25,91.45 93.59,91.45 85.45,83.32 85.45,81.95 82.2,78.7 U$1.91
PA4  (via drill 0.3 pad 0.81)
  Top 0.254: v80.59,64.57 78.84,62.82 v71.9,62.82
  Bottom 0.254: v80.59,64.57 84.47,68.45 84.47,72.07 U$1.30 84.7,75.25 83.55,76.4 83.55,78.98 86.41,81.83 86.41,83.38 93.2,90.18 XIO.7 | v71.9,62.82 69.35,60.28 69.35,57.44 70.54,56.25 MEGADRIVE.25
PA5  (via drill 0.3 pad 0.81)
  Top 0.254: v83.58,65.8 83.69,65.8 89.47,60.02 89.47,58.47 87,55.99 83.71,55.99 81.97,54.25 81.97,53.48 81.2,52.71 70.06,52.71 69.14,53.62 69.14,53.86 MEGADRIVE.24
  Bottom 0.254: XIO.8 95.25,88.91 92.58,88.91 87.02,83.35 87.02,79.63 U$1.92 85.87,76.14 85.87,70.24 84.92,69.29 84.92,67.15 v83.58,65.8
PA6  (via drill 0.3 pad 0.81)
  Top 0.254: XIO.9 55.9,87.64 53.45,85.19 37.04,85.19 v36.96,85.26 36.82,85.4 23.02,85.4 15.12,77.5 15.12,76.08 10.17,71.13 8.37,71.13 U$1.3 | v37.82,74.12 38.35,73.58 38.35,69.93 48.95,59.34 48.95,58.52 49.67,57.8 51.11,57.8 53.81,55.09 58.25,55.09 59.11,54.24 59.11,53.48 59.92,52.67 63.36,52.67 64.32,53.62 64.32,53.86 MEGADRIVE.23
  Bottom 0.254: v37.82,74.12 38.38,74.68 38.38,83.84 v36.96,85.26
PA7  (via drill 0.3 pad 0.81)
  Top 0.254: U$1.87 8.34,76.17 13.14,76.17 22.97,86 50.7,86 51.02,85.67 52.89,85.67 v54.28,87.06 56.06,88.84 95.31,88.84 XIO.10 | v54.16,56.19 54.66,55.68 60.2,55.68 61.78,54.1 61.78,53.86 MEGADRIVE.22
  Bottom 0.254: v54.16,56.19 54.16,67.51 55.95,69.3 55.95,72.94 56.22,73.22 56.22,75.39 56.06,75.55 56.06,85.28 v54.28,87.06
PB0  (via drill 0.3 pad 0.81)
  Top 0.254: v27.64,25.25 36.37,25.25 39.37,22.25 81.81,22.25 87.08,27.52 87.97,27.52 v88.44,27.05 | XIO.34 97.72,55.96 97.72,52.74 91.69,46.72 v90.72,46.72 | SDCARD.8 21.63,41.98 21.63,42.22 20.7,43.14 17.21,43.14 16.49,42.41 16.49,40.78 CN2.1
  Bottom 0.254: v90.72,46.72 88.17,44.17 88.17,27.32 v88.44,27.05 | v27.64,25.25 27.64,25.35 25.38,27.62 19.05,27.62 18.28,28.39 15.39,28.39 13.77,30 13.77,38.06 CN2.1 | SDCARD.7 SDCARD.8
PB1
  Top 0.254: XIO.33 92.78,55.96 92.78,50.79 93.11,50.46 93.11,48.85 92.17,47.91 88.88,47.91 87.63,49.16 87.63,49.93 85.92,51.64 61.99,51.64 61.65,51.29 53.43,51.29 52.07,49.93 52.07,49.15 48.8,45.88 41.89,45.88 41.65,46.12 40.66,46.12 40.1,45.56 33.94,45.56 31.74,43.37 22.24,43.37 21.63,43.98 21.63,44.85 20.79,45.69 19.76,45.69 18.83,44.76 18.83,44.52 SDCARD.11 | SDCARD.12 CN2.2
  Bottom 0.254: SDCARD.12 SDCARD.11
PB2  (via drill 0.3 pad 0.81)
  Top 0.254: v89.68,25.21 83.85,19.39 38.8,19.39 34.45,23.73 13.08,23.73 7.75,29.06 7.75,35.04 9.78,37.07 v17.86,37.07 | CN2.3 SDCARD.10
  Bottom 0.254: SDCARD.10 SDCARD.9 | XIO.32 95.27,58.45 95.27,50.53 94.55,49.82 94.55,40.74 94.52,40.7 94.52,28.55 91.18,25.21 v89.68,25.21 | v17.86,37.07 CN2.3
PB3  (via drill 0.3 pad 0.81)
  Top 0.254: v74.78,86.39 56.18,86.39 53.72,83.93 24.71,83.93 18.57,77.79 18.57,71.21 v16.63,69.27 | XIO.31 93.98,60.51 84.71,69.78 v74.94,69.78
  Bottom 0.254: SDCARD.13 15.15,43.38 16.09,42.44 16.09,41.98 | 16.09,41.98 16.29,41.98 16.29,41.74 17.38,40.66 22.77,40.66 | SDCARD.14 16.09,41.98 | 22.77,40.66 | 22.77,40.66 23.09,40.66 23.95,41.52 23.95,44.96 21.99,46.92 19.95,46.92 13.49,53.38 13.49,66.14 v16.63,69.27 | CN2.4 22.77,40.66 | v74.94,69.78 75.08,69.92 75.08,86.08 v74.78,86.39
PB4  (via drill 0.3 pad 0.81)
  Top 0.254: v13.95,43.2 12.28,43.2 6.8,48.67 6.8,60.83 v8.96,62.99 | LED.4 24.56,32.75 26.27,31.04 26.27,30.02 24.7,28.46 9.79,28.46 8.79,29.47 8.79,31.59 9.17,31.97 v16.29,31.97 | v31.58,84.67 22.93,84.67 15.73,77.47 v15.73,72.95
  Bottom 0.254: v15.73,72.95 8.96,66.18 v8.96,62.99 | v13.95,43.2 13.95,41.55 14.73,40.76 15.55,40.76 16.42,39.89 16.42,38.99 16.29,38.85 v16.29,31.97 | R20.1 37.1,89.16 36.07,89.16 v31.58,84.67
PB5
  Bottom 0.254: R19.1 34.06,89.16 30.84,85.94 30.84,71.83 30.14,71.13 29.24,71.13 28.45,71.92 28.45,72.66 27.66,73.44 21.72,73.44 20.98,72.7 20.98,70 16.01,65.03 16.01,53.43 19.23,50.21 21.24,50.21 26.58,44.87 26.58,38.97 25.82,38.21 23.46,38.21 21.27,36.02 21.27,33.48 LED.3
PB6  (via drill 0.3 pad 0.81)
  Top 0.254: LED.1 v11.27,32.75 | v10.89,38.63 6.35,43.17 6.35,67.03 v6.81,67.5
  Bottom 0.254: v10.89,38.63 11.27,38.24 v11.27,32.75 | 220R.1 31.02,91.42 30.4,91.42 27.69,94.14 27.69,98.19 26.9,98.98 25.94,98.98 25.15,98.19 25.15,97.34 22.24,94.43 14.89,94.43 10.84,90.38 10.84,71.6 6.81,67.57 v6.81,67.5
PC0  (via drill 0.3 pad 0.81)
  Top 0.254: v28.46,33.18 29.16,33.18 31.29,31.05 31.29,29.96 33.13,28.12 36.77,28.12 39.94,24.95 67.27,24.95 v68.95,26.64 | 58.76,60.98 v64.19,60.98 | 58.76,60.98 58.76,66.63 53.09,72.3 | 58.76,60.98 58.74,60.98 57.84,60.08 MEGADRIVE.52 | 53.09,72.3 U$1.19 | v90.76,66.43 | v90.76,66.43 90.76,67.07 87.59,70.24 76.57,70.24 72.89,73.92 69.72,73.92 68.45,72.66 68.45,71.9 67.7,71.15 66.74,71.15 65.95,71.94 65.95,72.69 64.29,74.34 55.14,74.34 53.09,72.3
  Bottom 0.254: 71.24,28.34 71.27,28.37 71.27,40.6 70.04,41.83 69.94,41.83 69.25,42.52 69.25,45 67.31,46.94 67.31,50.35 64.19,53.47 v64.19,60.98 | 71.24,28.34 70.88,27.98 70.29,27.98 v68.95,26.64 | 71.24,28.34 73.25,26.33 U$4.22 | v28.46,33.18 27.52,34.12 U$2.P33 | v90.76,66.43 92.81,68.47 92.81,72.89 93.59,73.67 94.38,73.67 95.35,74.65 95.35,76.31 XIO.18
PC1  (via drill 0.3 pad 0.81)
  Top 0.254: v67.61,64.02 77.85,64.02 v79.46,65.63 | v72.54,28.45 63.28,28.45 61.66,26.84 49.42,26.84 46.27,29.99 46.27,31.07 44.6,32.73 v32.8,32.73 | U$1.20 65.46,61.54 MEGADRIVE.55 | XIO.17 93.89,77.48 90.24,81.13 81.92,81.13 v81.67,81.37
  Bottom 0.254: v81.67,81.37 78.56,78.27 78.56,75.29 80.89,72.97 80.89,67.06 v79.46,65.63 | v67.61,64.02 65.46,61.87 MEGADRIVE.55 65.46,57.34 66.73,56.07 66.73,53.51 69.75,50.49 69.75,45.56 71.75,43.56 71.75,29.24 v72.54,28.45 72.63,28.45 74.75,26.33 U$4.23 | v32.8,32.73 32.52,33.02 U$2.P35
PC2  (via drill 0.3 pad 0.81)
  Top 0.254: U$1.21 57.2,71.59 66.75,62.04 69.12,62.04 71.94,59.23 71.94,58.94 MEGADRIVE.58 74.22,58.94 74.22,58.7 75.15,57.78 81.15,57.78 81.97,58.59 81.97,59.61 v83.77,61.41
  Bottom 0.254: XIO.16 95.25,78.75 95.25,77.08 94.38,76.21 93.55,76.21 91.9,74.56 91.9,69.54 v83.77,61.41 | MEGADRIVE.58 73.08,56.41 74.24,55.26 74.24,53.38 71.62,50.76 71.62,48.32 74.17,45.77 74.17,27.88 75.72,26.33 76.25,26.33 U$4.24
PC3  (via drill 0.3 pad 0.81)
  Top 0.254: MEGADRIVE.61 80.7,60.08 78.95,61.84 70.68,61.84 69.56,62.95 66.48,62.95 59.7,69.73 U$1.22 | v84.97,38.17 84.12,37.32 v79.28,37.32
  Bottom 0.254: v79.28,37.32 79.28,36.39 77.75,34.86 77.75,26.33 U$4.25 | v84.97,38.17 85.72,38.92 85.72,45.69 85.03,46.38 85.03,52.67 84.38,53.32 84.38,54.4 80.99,57.8 80.7,57.8 MEGADRIVE.61 80.7,60.69 90.18,70.17 90.18,76.22 XIO.15
PC4
  Top 0.254: U$1.70 53.1,77.31 58.67,82.88 76.35,82.88 76.68,82.55 77.29,82.55 77.79,83.05 87.95,83.05 88.47,82.53 90.17,82.53 91.41,83.76 95.32,83.76 XIO.14
  Bottom 0.254: XIO.14 95.25,81.29 93.59,81.29 89.72,77.42 89.72,70.36 83.48,64.12 82.09,64.12 78.48,60.52 78.48,59.26 MEGADRIVE.60 78.16,57.8 79.3,56.65 79.3,53.64 79.92,53.02 79.92,46.51 79.36,45.94 79.36,38.27 80.01,37.62 80.01,35.04 78.4,33.43 78.4,27.18 79.25,26.33 U$4.26
PC5  (via drill 0.3 pad 0.81)
  Top 0.254: v82.02,38.28 80.4,38.28 v80.19,38.49 | v55.44,73.6 55.95,73.09 55.95,71.93 66.74,61.14 67.43,61.14 69.4,59.18 69.4,58.94 MEGADRIVE.57 | U$1.71 59.82,82.42 76.16,82.42 76.49,82.09 77.48,82.09 77.98,82.59 87.76,82.59 88.28,82.07 93.49,82.07 XIO.13 | v71.66,47.24 73.78,47.24 74.15,47.62 v81.07,47.62
  Bottom 0.254: v80.19,38.49 80.47,38.21 80.47,34.85 78.88,33.26 78.88,28.2 80.75,26.33 U$4.27 | v81.07,47.62 81.07,47.34 84.3,44.11 84.3,41.52 82.02,39.23 v82.02,38.28 | U$1.71 55.44,76.57 v55.44,73.6 | v71.66,47.24 71.16,47.74 71.16,52.67 71.68,53.2 71.68,55.75 70.54,56.9 MEGADRIVE.57
PC6  (via drill 0.3 pad 0.81)
  Top 0.254: v79.65,32.87 77.03,32.87 71.76,38.14 65.01,38.14 v64.73,38.42 | XIO.12 97.7,83.92 97.7,82.06 97.03,81.39 90.63,81.39 90.43,81.58 82.5,81.58 81.97,82.11 80.18,82.11 79.71,81.63 76.3,81.63 75.97,81.97 67.04,81.97 v66.06,80.98 60.88,80.98 U$1.72
  Bottom 0.254: v64.73,38.42 64.73,50.36 61.74,53.35 61.74,54.32 62.92,55.5 MEGADRIVE.54 62.92,60.08 62.92,60.76 66.44,64.27 66.44,66.3 66.06,66.68 v66.06,80.98 | v79.65,32.87 79.38,32.61 79.38,29.2 82.25,26.33 U$4.28
PC7  (via drill 0.3 pad 0.81)
  Top 0.254: v83.33,28.25 | v83.33,28.25 83.33,30.29 81.49,32.13 76.46,32.13 70.91,37.68 60.36,37.68 v59.59,38.45 | U$1.73 62.27,79.88 66.12,79.88 67.75,81.51 75.78,81.51 76.11,81.18 80.82,81.18 81.61,80.39 v89.94,80.39
  Bottom 0.254: v59.59,38.45 59.59,50.09 58.74,50.94 56.6,50.94 54.16,53.39 54.16,54.87 55.3,56.01 MEGADRIVE.51 55.3,60.08 55.3,66.58 58.45,69.73 58.45,76.06 U$1.73 | XIO.11 89.94,81.06 v89.94,80.39 | v83.33,28.25 83.33,26.75 83.75,26.33 U$4.29
PD7  (via drill 0.3 pad 0.81)
  Top 0.254: v91.94,27.04 91.94,20.14 95.35,16.73 97.54,16.73 97.73,16.54 97.73,6.4 97.58,6.24 90.9,6.24 88.97,8.17 50.85,8.17 48.55,5.87 12.77,5.87 v11.09,7.54 10.95,7.41 S1.1
  Bottom 0.254: v91.94,27.04 91.94,41.99 93.46,43.51 93.46,52.17 87.14,58.49 87.14,64.03 92.35,69.24 92.35,73.31 XIO.19 | v11.09,7.54 10.52,7.54 8,10.07 8,17.97 3.5,22.47 10K.1
PE3  (via drill 0.3 pad 0.81)
  Top 0.254: v54.16,39.12 54.24,39.04 57.54,39.04 57.71,39.21 67.21,39.21 67.81,38.6 72.03,38.6 76.73,33.9 93.1,33.9 CLK0.1 | v51.97,51.12 48.78,51.12 46.28,53.62 46.28,53.86 MEGADRIVE.15
  Bottom 0.254: v54.16,39.12 51.97,41.31 v51.97,51.12 | PWML.6 49.6,99 45.26,99 43.56,97.3 43.56,65.94 43.95,65.56 43.95,56.19 45.14,55 MEGADRIVE.15
PE4
  Top 0.254: 2.94,77.18 5.95,74.17 5.95,71.89 16.32,61.53 19.02,61.53 21.01,59.54 21.01,58.55 23.48,56.08 34.39,56.08 36.38,54.1 36.38,53.86 MEGADRIVE.12 | U$1.89 2.81,77.31 2.94,77.18 | PWML.3 57.24,98.98 55.34,98.98 54.61,98.25 54.61,94.56 48.45,88.4 21.31,88.4 16.41,83.5 9.26,83.5 2.94,77.18
PE5  (via drill 0.3 pad 0.81)
  Top 0.254: PWML.4 55.88,95.19 48.3,87.6 21.8,87.6 14.82,80.61 8.01,80.61 U$1.88 | v57.32,66.84 | v57.32,66.84 56,66.84 50.84,72 v50.84,73.89 | v50.84,73.89
  Bottom 0.254: PWML.4 55.06,97.8 51.88,94.63 51.26,94.63 50.56,93.93 50.56,86.13 50.84,85.86 v50.84,73.89 | v57.32,66.84 57.26,66.78 57.26,62.91 58.98,61.19 58.98,56.4 60.38,55 MEGADRIVE.21
PG0  (via drill 0.3 pad 0.81)
  Top 0.254: v71.28,80.77 71.33,80.72 80.31,80.72 81.13,79.9 87.12,79.9 93.36,73.67 95.25,73.67 XIO.22
  Bottom 0.254: v71.28,80.77 66.22,85.83 65.86,85.83 CIC.3
PG1  (via drill 0.3 pad 0.81)
  Top 0.254: v70.26,80.4 70.62,80.03 80.02,80.03 80.97,79.09 87.29,79.09 XIO.21
  Bottom 0.254: v70.26,80.4 64.83,85.83 64.59,85.83 CIC.4
PG2  (via drill 0.3 pad 0.81)
  Top 0.254: v86.89,28.49 88.1,28.49 90.43,26.16 90.43,24.92 83.57,18.05 v42.32,18.05 32.39,8.12 28.51,8.12 27.8,7.41 S2.1 | XIO.20 97.71,73.75 97.71,64.31 96.81,63.41 96.03,63.41 95.15,62.53 95.15,59.17 94.41,58.43 93.51,58.43 91.63,56.55 v91.63,51.55
  Bottom 0.254: v91.63,51.55 90.27,50.19 90.27,49.02 86.89,45.64 v86.89,28.49 | v42.32,18.05 41.92,18.05 37.5,22.47 1000R.1
PG5  (via drill 0.3 pad 0.81)
  Top 0.254: PWML.5 53.34,93.97 48.62,89.25 v45.67,89.25 21.38,89.25 16.09,83.96 7.24,83.96 1.02,77.74 1.02,75.98 U$1.2 | v49.29,66.37 49.29,65.95 51.15,64.09 51.8,64.09 56.57,59.32 56.57,58.57 57.35,57.8 v71.47,57.8
  Bottom 0.254: v45.67,89.25 46.06,88.86 46.06,69.6 v49.29,66.37 | v71.47,57.8 71.47,56.62 73.08,55 MEGADRIVE.26
PH0  (via drill 0.3 pad 0.81)
  Top 0.254: v72.37,48.76 70.26,48.76 63.3,41.8 62.38,41.8 61.28,40.7 57.11,40.7 56.28,39.86 53.84,39.86 53.4,39.41 53.4,38.84 53.85,38.38 53.91,38.38 56.27,36.03 56.27,34.54 v57.27,33.54 | v85.21,30.77 85.21,28.62 v84.1,27.51 | v84.46,45.64 83.87,46.23 v75.03,46.23 | U$1.26 70.86,73.46 72.64,73.46 74.26,71.85 v74.26,71.13
  Bottom 0.254: 72.41,48.76 72.41,49.98 75.15,52.72 75.62,52.72 MEGADRIVE.27 75.62,55 74.26,56.37 74.26,68.84 74.17,68.92 74.17,71.04 v74.26,71.13 74.61,71.48 74.61,83.7 74.04,84.27 74.04,95.64 COMMUNICATION.5 | 72.41,48.76 v72.37,48.76 | v75.03,46.23 74.94,46.23 72.41,48.76 | v85.21,30.77 85.21,36.21 84.23,37.19 84.23,40.14 85.26,41.17 85.26,44.84 v84.46,45.64 | v84.1,27.51 84.1,27.48 85.25,26.33 U$4.30 | v57.27,33.54 57.52,33.29 U$2.P20
PH1  (via drill 0.3 pad 0.81)
  Top 0.254: CLK1.1 96.85,41 97.73,40.12 97.73,37.95 97.52,37.73 93.43,37.73 91.61,35.91 77.36,35.91 73.22,40.05 69.47,40.05 68.33,41.2 62.82,41.2 v62.69,41.07
  Bottom 0.254: 56.31,53.86 56.31,53.77 58.69,51.4 60.84,51.4 62.15,50.09 62.15,41.61 v62.69,41.07 | COMMUNICATION.6 71.37,95.51 53.42,95.51 52.09,94.17 51.45,94.17 51.02,93.74 51.02,91.49 60.87,81.64 60.87,71.43 56.57,67.13 56.57,54.12 56.31,53.86 | MEGADRIVE.19 56.31,53.86
PH3
  Bottom 0.254: U$4.5 47.75,26.78 46.27,28.26 46.27,31.07 43.77,33.57 43.77,36.47 47.09,39.79 47.09,50.48 49.33,52.72 50.22,52.72 50.22,53.57 MEGADRIVE.17 50.22,55 49.06,56.16 49.06,61.52 51.13,63.59 51.13,68.77 51.06,68.83 51.06,72.58 49.7,73.94 U$1.69 49.7,96.36 PWML.7
PH4  (via drill 0.3 pad 0.81)
  Top 0.254: v81.07,30.86 76.44,30.86 70.53,36.77 61.98,36.77 61.27,36.06 61.27,31.77 U$2.P21 | U$1.18 48.55,71.15 48.55,66.05 51.62,62.98 51.62,58.4 53.09,56.92 54.74,56.92 55.17,56.49 69.76,56.49 70.28,55.97 77.74,55.97 79.56,54.15 79.56,53.86 MEGADRIVE.29
  Bottom 0.254: U$1.18 48.45,73.55 48.45,95.07 PWML.8 | 83,31.04 82.83,30.86 v81.07,30.86 | 83,31.04 83.84,31.04 85.23,29.64 85.23,27.85 86.75,26.33 86.75,24.89 U$4.31 86.75,20.67 95.17,20.67 EEP.2 | 83,31.04 CONTROLLER.1 83,32.97 83.89,32.97 84.63,33.71 84.63,36.12 83.77,36.98 83.77,40.34 84.79,41.36 84.79,44.27 82.55,46.51 82.55,50.87 80.7,52.72 MEGADRIVE.29
PH5  (via drill 0.3 pad 0.81)
  Top 0.254: MEGADRIVE.28 77.02,53.86 77.02,54.1 75.7,55.42 61.92,55.42 v61.65,55.69 | v51.76,93.43 46.02,93.43 PINS.10
  Bottom 0.254: 28.12,30.59 29.2,31.67 29.2,33.94 28.79,34.35 28.79,36.11 31.64,38.96 33.32,38.96 36.74,42.38 36.74,52.76 36.37,53.13 36.37,54.33 38.87,56.83 38.87,60.9 41.43,63.47 41.43,70.26 41.06,70.63 41.06,97.21 PINS.10 | U$2.P8 28.05,30.52 28.12,30.59 | v61.65,55.69 61.65,60.49 65.98,64.82 65.98,65.95 63.41,68.52 63.41,72.94 62.2,74.15 U$1.74 62.2,82.99 v51.76,93.43 | 28.12,30.59 31.36,27.36 32.42,27.36 34.72,25.05 38.33,25.05 38.83,24.55 38.83,22.25 40.9,20.18 44.26,20.18 44.75,20.67 U$4.3
PH6  (via drill 0.3 pad 0.81)
  Top 0.254: v28.05,75.04 28.57,74.53 28.57,70.05 38.72,59.9 38.72,58.65 41.71,55.66 45.88,55.66 MEGADRIVE.16 | v50.39,65.93 v58.02,65.93
  Bottom 0.254: 38.77,29.98 38.02,29.23 33.81,29.23 U$2.P10 | 46.54,53.86 46.54,52.16 44.35,49.97 44.35,41.63 38.77,36.05 38.77,29.98 | 38.77,29.98 40.1,28.65 43.93,28.65 46.25,26.33 U$4.4 | U$1.23 62.2,70.11 v58.02,65.93 | 46.54,53.86 46.54,62.08 v50.39,65.93 | v28.05,75.04 28.45,75.44 28.45,84.57 32.35,88.47 32.35,90.87 32.9,91.42 37.73,91.42 39.12,92.81 PINS.9 | MEGADRIVE.16 46.54,53.86
PJ0  (via drill 0.3 pad 0.81)
  Top 0.254: COMMUNICATION.7 69.94,98.98 67.88,98.98 64.43,95.53 58.15,95.53 49.64,87.03 21.88,87.03 14.93,80.08 8.25,80.08 6.06,77.89 6.06,75.94 U$1.4 | MEGADRIVE.31 85.78,55 86.67,55 89.94,58.27 89.94,60.53 81.62,68.84 v76.81,68.84
  Bottom 0.254: COMMUNICATION.7 72.3,98.98 76.74,98.98 77.38,98.34 77.38,86.01 76.16,84.79 76.16,69.49 v76.81,68.84
PJ1  (via drill 0.3 pad 0.81)
  Top 0.254: U$1.86 12.99,77.31 22.14,86.46 v51.43,86.46 v51.44,86.45 58.49,93.5 64.28,93.5 COMMUNICATION.8
  Bottom 0.254: MEGADRIVE.18 52.76,55 51.59,56.17 51.59,68.02 53.34,69.76 53.34,84.55 v51.44,86.45
PL0
  Top 0.254: 31.07,77.31 31.07,76.83 33.45,74.45 33.45,71.78 44.62,60.61 45.1,60.61 46.54,59.18 46.54,58.94 MEGADRIVE.48 | XIO.30 98.17,63.89 98.17,84.1 97.77,84.5 97.77,85.6 97.08,86.3 93.35,86.3 91.52,84.47 88.47,84.47 88,84.94 76.29,84.94 76.07,84.71 57.73,84.71 55.54,82.52 35.77,82.52 31.07,77.82 31.07,77.31 | 31.07,77.31 U$1.77
PL1  (via drill 0.3 pad 0.81)
  Top 0.254: U$1.76 36.72,81.82 55.49,81.82 57.92,84.25 76.26,84.25 76.48,84.48 87.81,84.48 88.56,83.73 v89.2,83.73 | XIO.29 93.18,62.24 86.54,68.88 v86.54,69
  Bottom 0.254: v86.54,69 86.54,69.3 88.81,71.57 88.81,79.83 88.74,79.89 88.74,83.28 v89.2,83.73 | U$1.76 33.34,76.17 33.34,70.11 23.55,60.32 23.55,56.27 22.28,55 MEGADRIVE.6
PL2  (via drill 0.3 pad 0.81)
  Top 0.254: 36.06,74.89 36.06,71.65 v35.35,70.93 | 36.06,74.89 34.7,76.25 U$1.67 | XIO.28 95.28,66.02 92.46,66.02 87.78,70.7 78.26,70.7 74.05,74.91 61.29,74.91 61.18,74.8 45.08,74.8 44.99,74.89 36.06,74.89
  Bottom 0.254: v35.35,70.93 35.35,69.48 25.96,60.1 25.96,56.15 24.82,55 MEGADRIVE.7
PL3  (via drill 0.3 pad 0.81)
  Top 0.254: U$1.66 41.26,81.37 55.68,81.37 58.11,83.8 76.44,83.8 76.67,84.02 87.62,84.02 88.66,82.98 89.58,82.98 v90.22,83.63 | XIO.27 91.34,64.78 87.55,68.57 v87.55,69.24
  Bottom 0.254: U$1.66 35.99,76.1 35.99,71.33 36.08,71.24 36.08,69.26 28.5,61.68 28.5,56.15 27.36,55 MEGADRIVE.8 | v90.22,83.63 89.2,82.61 89.2,80.08 89.26,80.02 89.26,70.95 v87.55,69.24
PL4
  Top 0.254: U$1.65 41.3,75.71 46.67,75.71 47.12,75.26 60.99,75.26 61.1,75.37 76.78,75.37 78.71,73.44 87.67,73.44 92.52,68.59 95.25,68.59 XIO.26
  Bottom 0.254: MEGADRIVE.9 29.9,55 31.17,56.27 31.17,60.23 38.44,67.5 38.44,73.69 39.7,74.95 U$1.65
PL5  (via drill 0.3 pad 0.81)
  Top 0.254: U$1.64 45.8,80.91 55.87,80.91 58.3,83.34 76.93,83.34 v76.99,83.28 | XIO.25 92.67,67.32 88.83,71.16 79.02,71.16 v76.93,73.25 | v42.09,73.94 40.95,72.8 40.95,71.9 39.5,70.45 v39.18,70.45
  Bottom 0.254: v76.99,83.28 76.99,73.31 v76.93,73.25 | v39.18,70.45 39.18,66.14 33.71,60.67 33.71,56.27 32.44,55 MEGADRIVE.10 | U$1.64 42.09,77.2 v42.09,73.94
PL6  (via drill 0.3 pad 0.81)
  Top 0.254: U$1.63 45.84,78.45 50.2,78.45 50.95,77.69 50.95,76.94 51.72,76.17 60.24,76.17 60.95,76.88 60.95,77.67 62.66,79.38 80.03,79.38 80.78,78.63 84.98,78.63 85.84,77.78 85.84,77.06 86.72,76.17 88.24,76.17 93.39,71.03 95.35,71.03 XIO.24 | v40.66,68.93 43.45,71.72 43.45,72.68 v44.7,73.93
  Bottom 0.254: v40.66,68.93 40.66,64.9 36.38,60.62 36.38,56.4 34.98,55 MEGADRIVE.11 | U$1.63 v44.7,73.93
PL7
  Top 0.254: U$1.68 48.8,75.71 60.8,75.71 60.91,75.83 77.94,75.83 79.87,73.9 87.86,73.9 91.9,69.86 XIO.23
SCL  (via drill 0.3 pad 0.81)
  Top 0.254: OLED.3 23.53,27.66 35.48,27.66 38.66,24.49 72.29,24.49 v75.49,27.68 | v75.5,44.91 90.53,44.91 98.63,53.01 98.63,84.4 98.23,84.8 98.23,90.2 96.98,91.45 92.62,91.45 86.36,97.71 COMMUNICATION.1
  Bottom 0.254: v75.49,27.68 74.62,28.55 74.62,42.12 CLOCKGEN.4 v75.5,44.91
SDA  (via drill 0.3 pad 0.81)
  Top 0.254: OLED.4 35.94,26.4 38.31,24.03 73.66,24.03 v76.84,27.21
  Bottom 0.254: v76.84,27.21 76.24,27.81 76.24,41.2 CLOCKGEN.3 77.47,43.57 77.47,52.62 76.76,53.32 76.76,64.08 76.37,64.47 76.37,65.59 77.69,66.91 77.69,73.66 77.61,73.74 77.61,79.22 77.88,79.48 77.88,91.86 COMMUNICATION.2
VCC  (via drill 0.3 pad 0.81)
  Top 0.61: 89.97,43 v89.97,42.97 | CLOCKGEN.1 89.97,43 | v97.91,48.51 95.48,48.51 89.97,43 | v80.14,30.09 80.08,30.14 72.01,30.14 70.97,29.1 51.44,29.1 U$2.P17 50.02,32.1 48.31,33.81 | U$1.27 72.2,67.21 72.94,66.47 77.55,66.47 77.63,66.55 79.97,66.55 85.78,60.74 85.78,60.26 MEGADRIVE.63 | U$2.P42 48.31,33.81 | 48.31,33.81 31.73,33.81 U$2.P34 28.6,34.1 27.67,34.1 27.54,33.97 | 10.16,50.92 8.26,52.82 8.26,54.91 10.96,57.62 12.12,57.62 MEGADRIVE.34 | 10.16,50.92 29.1,50.92 POWER.2 31.83,48.19 36.75,48.19 POWER.5 | 10.16,50.92 10.16,50.26 v9.86,49.95 | 27.54,33.97 21.22,33.97 LED.2 | 27.54,33.97 27.54,32.8 29.83,30.52 U$2.P9 | XIO.2 XIO.1
  Bottom 0.61: XIO.2 97.91,96.41 v97.91,48.51 97.93,48.49 97.93,12.93 VOLTAGE.2 | 1K.1 89.5,42.5 v89.97,42.97 92.79,45.79 92.79,51.68 86.86,57.62 85.78,57.62 MEGADRIVE.63 | U$2.P34 32.75,38.25 33.53,38.25 38.1,42.81 POWER.5 | CLOCKGEN.1 81.11,40.99 81.11,32.19 80.14,31.22 v80.14,30.09 80.72,29.5 81.29,29.5 PAD3.1 | v9.86,49.95 9.86,41.4 6.25,37.79 6.25,35.32 | U$1.27 71.99,72.51 71.99,77.09 U$1.83 72.2,81.86 68.41,85.65 CIC.1 68.41,88.7 69.94,88.7 70.09,88.85 100NF.1 | U$2.P9 32.51,28.03 34.36,28.03 35.99,26.4 1000R.2 39.01,26.4 39.12,26.51 41.75,26.51 U$4.1 | 6.25,35.32 5.6,35.32 5.06,34.77 SJ2.3 2.44,34.77 1.96,34.3 1.96,29.24 3.5,27.71 10K.2 | SJ4.3 6.25,35.32
VIN
  Bottom 0.61: U$2.P13 U$2.P38 40.02,35.7 45,40.68 45,48.82 POWER.8
(copper drawn outside any net)
  shapes: Top area x33, Top circle x1

## Text on the board
Top: CARTRIDGE READER
bPlace: +
tNames: JLCJLCJLCJLC | CLK1 | CLK0 | EEP | 5V | 3V | ON
bNames: SNESCIC | 12F629 | 22uf | 220R | 220R | 220R | 1 | 100nF | GND | WRM / / REF / / PA7 / / PAW / / / / / / GND / / A12 / / A13 / / A14 / / A15 / / BA0 / / BA1 / / BA2 / / BA3 / / BA4 / / BA5 / / BA6 / / / BA7 / / CS / / D4 / / D5 / / D6 / / D7 / / WR / / C0 / / CIC / / CPU / / VCC / / / / / / PA1 / / PA3 / / PA5 / / RA | SNES | CLK / / EXP / / PA6 / / PAR / / / / / / GND / / A11 / / A10 / / A9 / / A8 / / A7 / / A6 / / A5 / / A4 / / A3 / / A2 / / A1 / / / A0 / / IRQ / / D0 / / D1 / / D2 / / D3 / / RD / / C1 / / RIN / / RST / / VCC / / / / / / PA0 / / PA2 / / PA4 / / LA | GND | 5V | GND / / VCC / / A8 / / A11 / / A7 / / A12 / / A6 / / A13 / / A5 / / A14 / / A4 / / A15 / / A3 / / A16 / / A2 / / A17 / / A1 / / GND / / D7 / / D0 / / D8 / / D6 / / D1 / / D9 / / D5 / / D2 / / D10 / / D4 / / D3 / / D11 / / VCC / / GND | A9 / / A10 / / A18 / / A19 / / A20 / / A21 / / A22 / / A23 / / / / / / / / / / OE / / CS / / / / / / / / / / D15 / / D14 / / D13 / / D12 / / / / RST / / WRL / / WRH / / / / TME | MD | GND | MISO | SCK | MOSI | CS | 5V | 3V | GD | SD | CLK0 | CLK1 | CLK2 | SCL | SDA | GND | VCC | OLED | VCC | GND / / GND / / AD0 / / AD1 / / AD2 / / GND / / AD3 / / aleL / / VCC / / aleH / / AD4 / / AD5 / / 12V / / / / AD6 / / AD7 / / VCC / / / / / / / / / / GND / / GND | GND | PIN1 | PIN2 | 1K | CONTR | DAT | N64 | GND | VCC | GND / / GND / / AD15 / / AD14 / / AD13 / / GND / / AD12 / / WR / / VCC / / RD / / AD11 / / AD10 / / 12V / / / / AD9 / / AD8 / / VCC / / / / CLK / / RST / / DAT / / GND / / GND / / / / GND | 10K | 10K | PN1 | PN2 | SCL | SDA | OLED | VCC / CLK / WR / RD / CS1 / AD0 / AD1 / AD2 / AD3 / AD4 / AD5 / AD6 / AD7 / AD8 / AD9 / AD10 / AD11 / AD12 / AD13 / AD14 / AD15 / D0/A16 / D1/A17 / D2/A18 / D3/A19 / D4/A20 / D5/A21 / D6/A22 / D7/A23 / RST/CS2 / AUD/IRQ / GND | GBA
tStop: CARTRIDGE READER
tRestrict: CARTRIDGE READER